# EAGLE schematic Slave (EAGLE 9.2.2)
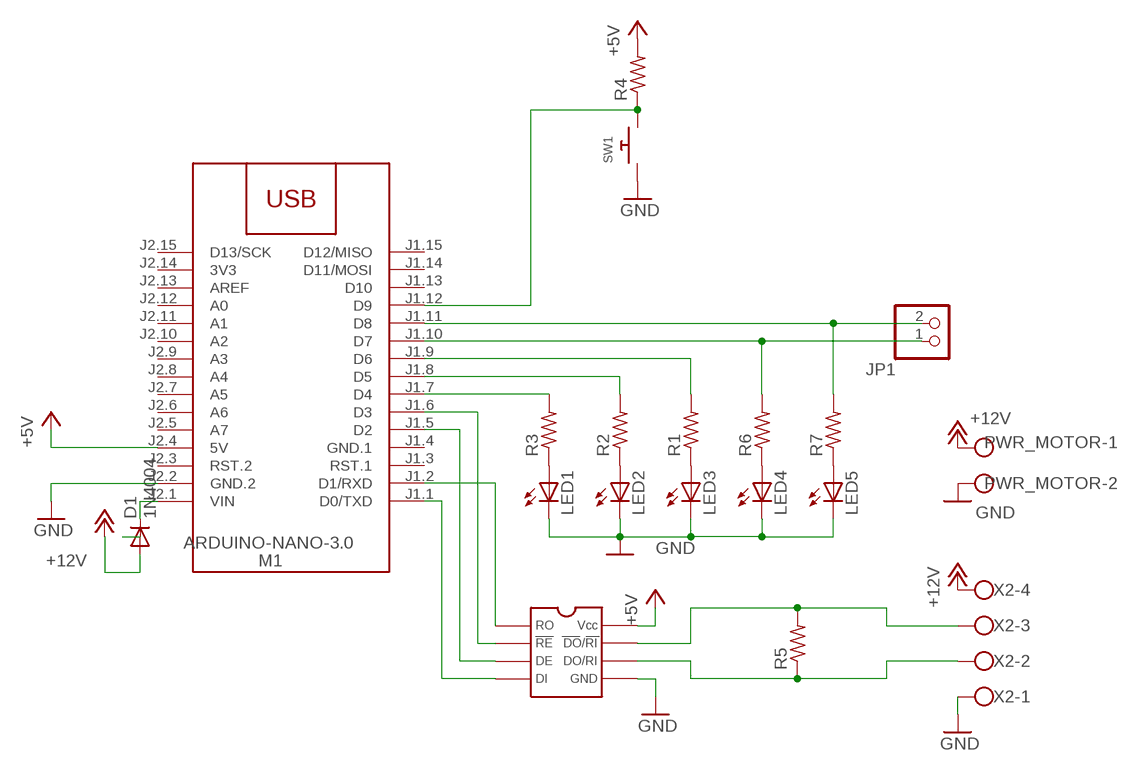
[diagram p0: schematic, sheet 1]

## Parts
D1  1N4004  [DO41-10]
JP1  PINHD-1X2  [1X02]
LED1  LED5MM  [LED5MM]
LED2  LED5MM  [LED5MM]
LED3  LED5MM  [LED5MM]
LED4  LED5MM  [LED5MM]
LED5  LED5MM  [LED5MM]
M1  ARDUINO-NANO-3.0  [ARDUINO-NANO-3.0]
PWR_MOTOR  W237-102  [W237-102]
R1  FLIPFLOP-RES  [0805-THM]
R2  FLIPFLOP-RES  [0805-THM]
R3  FLIPFLOP-RES  [0805-THM]
R4  FLIPFLOP-RES  [0805-THM]
R5  FLIPFLOP-RES  [0805-THM]
R6  FLIPFLOP-RES  [0805-THM]
R7  FLIPFLOP-RES  [0805-THM]
SW1  SWITCH_PUSHBUTTONEVQ-PE  [TACT_PANA-EVQ]
U1  DS3956N  [DIL08]
X2  W237-4  [W237-4]

## Nets
+5V: M1.J2.4(5V) R4.2 U1.8(VCC)
+12V: D1.A PWR_MOTOR.1 X2.4
GND: LED1.K(C) LED2.K(C) LED3.K(C) LED4.K(C) LED5.K(C) M1.J2.2(GND.2) PWR_MOTOR.2 SW1.P$1 U1.5(GND) X2.1
N$1: LED3.A R1.1
N$2: LED2.A R2.1
N$3: LED1.A R3.1
N$4: M1.J1.12(D9) R4.1 SW1.P$2
N$5: R5.1 U1.6(DO/RI) X2.2
N$6: R5.2 U1.7(_DO/RI_) X2.3
N$7: M1.J1.6(D3) U1.2(_RE_)
N$8: M1.J1.5(D2) U1.3(DE)
N$9: M1.J1.2(D1/RXD) U1.1(RO)
N$10: M1.J1.1(D0/TXD) U1.4(DI)
N$11: M1.J1.7(D4) R3.2
N$12: M1.J1.8(D5) R2.2
N$13: M1.J1.9(D6) R1.2
N$14: JP1.2 M1.J1.11(D8) R7.2
N$15: JP1.1 M1.J1.10(D7) R6.2
N$16: D1.C M1.J2.1(VIN)
N$18: LED4.A R6.1
N$19: LED5.A R7.1
Unconnected: M1.J1.3(RST.1) M1.J1.13(D10) M1.J1.14(D11/MOSI) M1.J1.15(D12/MISO) M1.J2.3(RST.2) M1.J2.5(A7) M1.J2.6(A6) M1.J2.7(A5) M1.J2.8(A4) M1.J2.9(A3) M1.J2.10(A2) M1.J2.11(A1) M1.J2.12(A0) M1.J2.13(AREF) M1.J2.15(D13/SCK)

## Power pins joined to a net without a drawn wire
3V3: M1.J2.14(3V3)
GND.1: M1.J1.4(GND.1)

## Library data of the parts
D1 = adafruit:1N4004: DIODE General purpose 1N400x type rectifier (With bigger pads) http://www.ladyada.net/library/pcb/eaglelibrary.html
JP1 = pinhead:PINHD-1X2: PIN HEADER
LED1-LED5 = adafruit:LED: LED OSRAM: - CHIPLED LG R971, LG N971, LY N971, LG Q971, LY Q971, LO R971, LY R971 LH N974, LH R974 LS Q976, LO Q976, LY Q976 LO Q996 - Hyper CHIPLED LW Q18S LB Q993, LB Q99A, LB R99A - SideLED LS A670, LO A670, LY A670, LG A670, LP A670 LB A673, LV A673, LT A673, LW A673 LH A674 LY A675 LS A676, LA A676, LO A676, LY A676, LW A676 LS A679, LY A679, LG A679 - Hyper Micro SIDELED® LS Y876, LA Y876, LO Y876, LY Y876 LT Y87S - SmartLED LW L88C, LW L88S LB L89C, LB L89S, LG L890 LS L89K, LO L89K, LY L89K LS L896, LA L896, LO L896, LY L896 - TOPLED LS T670, LO T670, LY T670, LG T670, LP T670 LSG T670, LSP T670, LSY T670, LOP T670, LYG T670 LG T671, LOG T671, LSG T671 LB T673, LV T673, LT T673, LW T673 LH T674 LS T676, LA T676, LO T676, LY T676, LB T676, LH T676, LSB T676, LW T676 LB T67C, LV T67C, LT T67C, LS T67K, LO T67K, LY T67K, LW E67C LS E67B, LA E67B, LO E67B, LY E67B, LB E67C, LV E67C, LT E67C LW T67C LS T679, LY T679, LG T679 LS T770, LO T770, LY T770, LG T770, LP T770 LB T773, LV T773, LT T773, LW T773 LH T774 LS E675, LA E675, LY E675, LS T675 LS T776, LA T776, LO T776, LY T776, LB T776 LHGB T686 LT T68C, LB T68C - Hyper Mini TOPLED® LB M676 - Mini TOPLED Santana® LG M470 LS M47K, LO M47K, LY M47K Source: http://www.osram.convergy.de/
M1 = diy-modules:ARDUINO-NANO-3.0: Arduino Nano 3.0
PWR_MOTOR = con-wago-500:W237-102: WAGO SCREW CLAMP; MPN: 237-102; OC_FARNELL: unknown; OC_NEWARK: 70K9898
R1-R7 = adafruit:FLIPFLOP-RES: Flip Flop resistor An 0805 resistor inside a standard 1/4W 5% resistor. Makes for easy mods
SW1 = adafruit:SWITCH_PUSHBUTTON: Buttons SOFTTOUCHSMD_SJ - Soft touch temporary push button (Super Junk Akihabara) Compatible with SKPMANE010 [Mouser: 688-SKPMAN] C&K_KSS = Digikey: KSS221GLFS
U1 = DS3695N_RS485_Transceiver:DS3956N
X2 = con-wago-500:W237-4: WAGO SCREW CLAMP; OC_FARNELL: unknown; OC_NEWARK: unknown